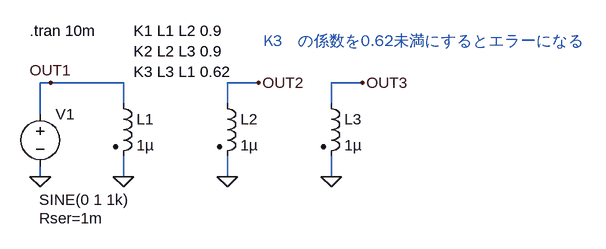
[diagram p0: schematic Fig_2-117-app_Inductor_K3.asc]
Fig_2-117-app_Inductor_K3.asc, the LTspice schematic file:
Version 4
SHEET 1 880 680
WIRE -32 96 -48 96
WIRE 80 96 -32 96
WIRE 288 96 240 96
WIRE 448 96 400 96
WIRE 80 128 80 96
WIRE 240 128 240 96
WIRE 400 128 400 96
WIRE -48 144 -48 96
WIRE -48 240 -48 224
WIRE 80 240 80 208
WIRE 240 240 240 208
WIRE 400 240 400 208
FLAG 80 240 0
FLAG 240 240 0
FLAG 400 240 0
FLAG -32 96 OUT1
FLAG 288 96 OUT2
FLAG 448 96 OUT3
FLAG -48 240 0
SYMBOL ind2 64 112 R0
SYMATTR InstName L1
SYMATTR Value 1µ
SYMATTR Type ind
SYMBOL ind2 224 112 R0
SYMATTR InstName L2
SYMATTR Value 1µ
SYMATTR Type ind
SYMBOL ind2 384 112 R0
SYMATTR InstName L3
SYMATTR Value 1µ
SYMATTR Type ind
SYMBOL voltage -48 128 R0
WINDOW 3 -2 148 Left 2
WINDOW 123 0 0 Left 0
WINDOW 39 -2 176 Left 2
SYMATTR Value SINE(0 1 1k)
SYMATTR SpiceLine Rser=1m
SYMATTR InstName V1
TEXT 96 16 Left 2 !K1 L1 L2 0.9\nK2 L2 L3 0.9\nK3 L3 L1 0.62
TEXT -64 16 Left 2 !.tran 10m
TEXT 296 32 Left 2 ;K3　の係数を0.62未満にするとエラーになる

The netlist it stands for:
* Fig_2-117-app_Inductor_K3.asc
L1 OUT1 0 1µ
L2 OUT2 0 1µ
L3 OUT3 0 1µ
V1 OUT1 0 SINE(0 1 1k) Rser=1m
K1 L1 L2 0.9
K2 L2 L3 0.9
K3 L3 L1 0.62
.tran 10m
* K3　の係数を0.62未満にするとエラーになる
.backanno
.end